# Altium schematic sheet 28Pins_Schematic.SchDoc (part 5 of 5)
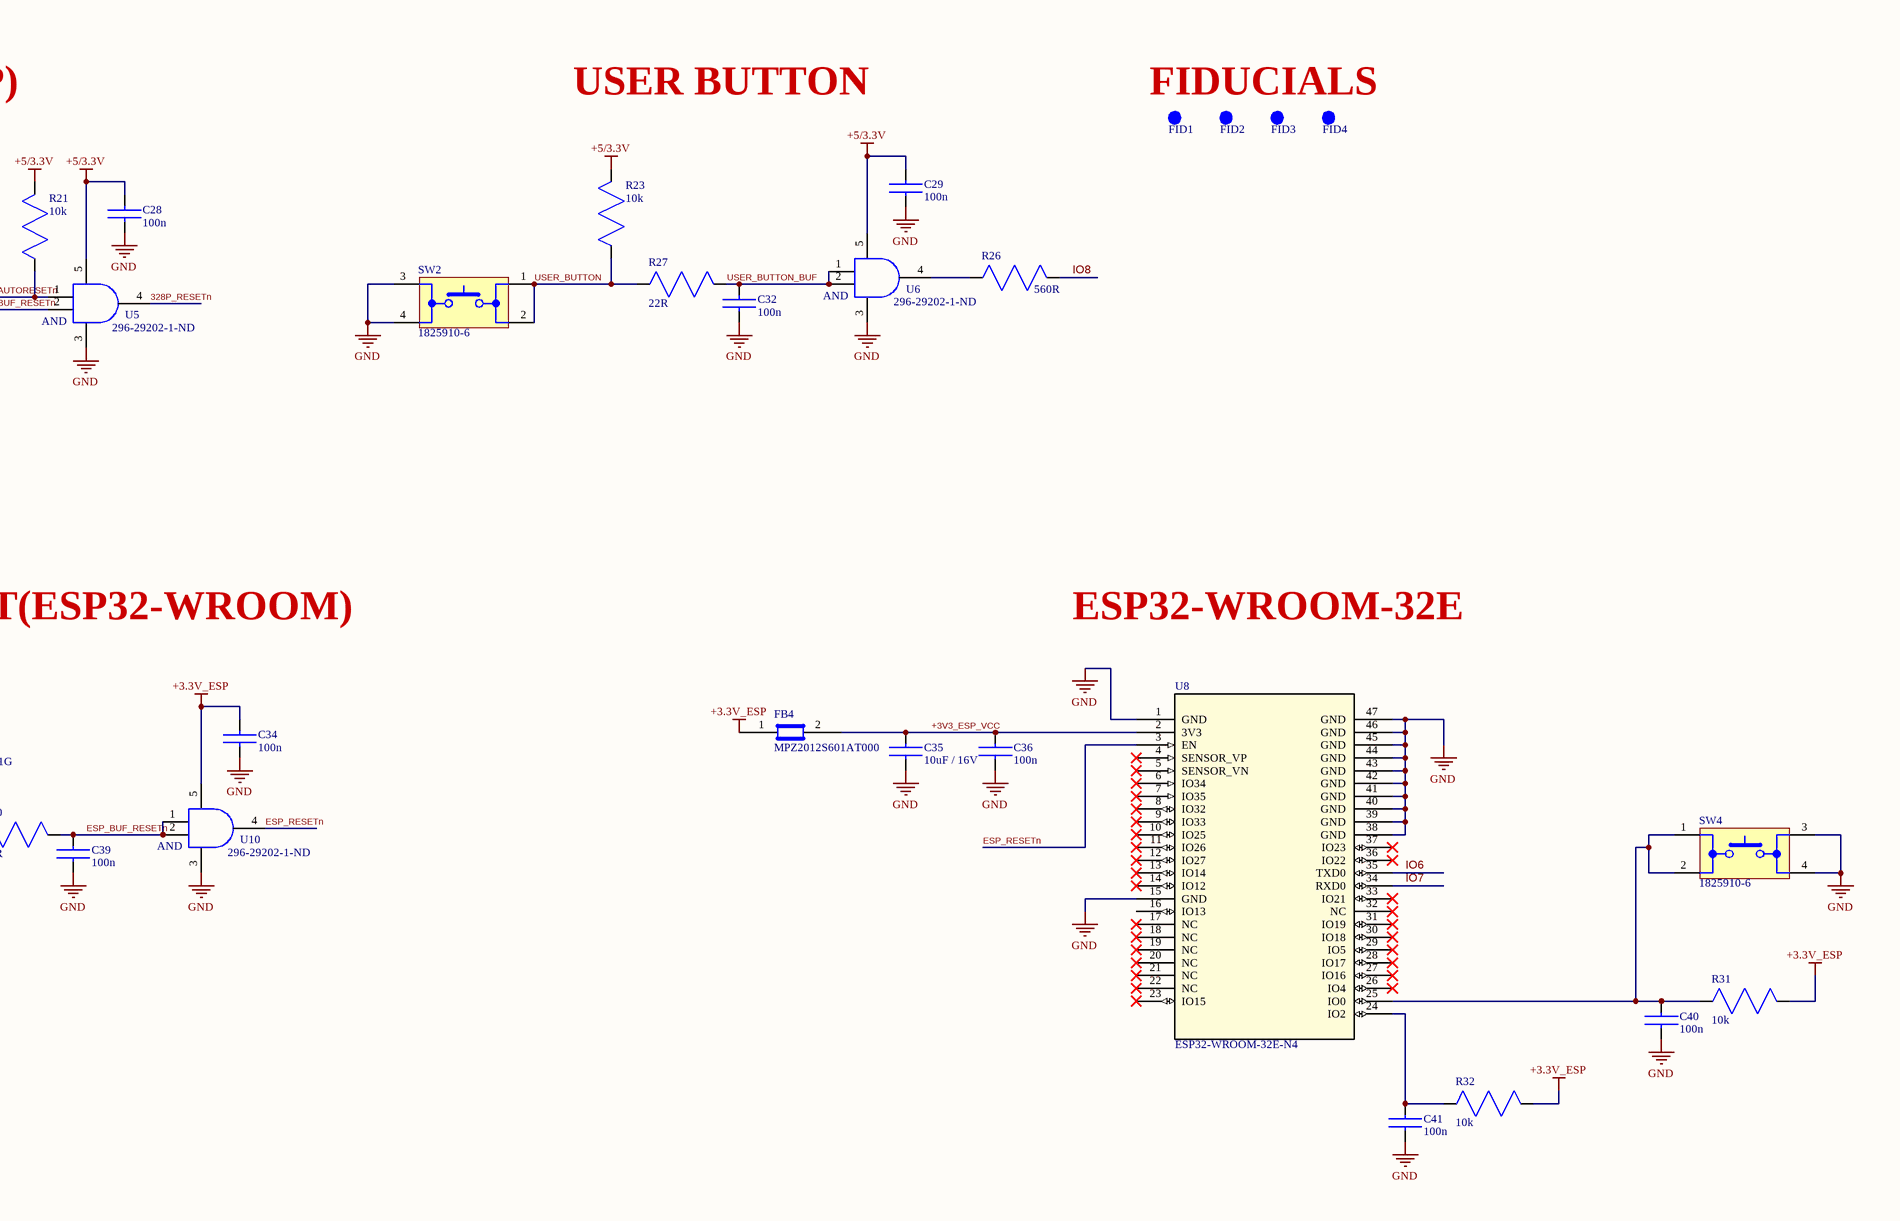
[diagram p7: 28Pins_Schematic.SchDoc, bottom right]

## Library data of the parts (continued)
U4 = ATMEGA328P-PU: Microchip - ATMEGA328P-PU - Microcontroller Mcu, 8 Bit, Atmega, 20MHZ, DIP-28; Core Architecture: AVR; Data Bus Width: 8b; Interface: 2-Wire, I2C, SPI, UART, USART; Max Supply Voltage: 5.5V; Memory Size: 32kB; Memory Format: FLASH; Min Supply Voltage: 1.8V; Number of ADC Channels: 6; Number of I2C Channels: 1; Number of I/Os: 23; Number of Timers/Counters: 3; Oscillator Type: Internal; Peripherals: Brown-out Detect/Reset, POR, PWM, WDT; RAM Size: 2kB; Watchdog Timer: Yes; Supplier: Farnell; Supplier Part Number: 1715487; Manufacturer: Microchip; Manufacturer Part Number: ATMEGA328P-PU; RoHS: Compliant; Category: Microcontrollers; Stock: 17449; Pricing: 1=3.296, 25=3.229 (USD); Projected EOL Date: 2039-11-04; Case/Package: PDIP; Contact Plating: Tin; Country of Assembly: Thailand; Country of Fabrication: United States of America; Country of Origin: Thailand; Export Control Classification Number (ECCN) Code: EAR99; Frequency: 20MHz; Height: 3.28mm; Harmonized Tariff Schedule (HTS) Code: 8542.31.0015; Lead Free: Lead Free; Length: 37.4mm; Lifecycle Status: Production; Clock Frequency: 20MHz; Max Operating Temperature: 85°C; Min Operating Temperature: -40°C; Mounting Technology: Through Hole; Pins: 28; Number of Programmable I/O: 23; Number of PWM Channels: 6; Number of SPI Channels: 1; Radiation Hardening: No; REACH SVHC: No; Schedule B: 8542310000, 8542310000|8542310000|8542310000|8542310000|8542310000; Width: 6.76mm; ComponentLink1URL: https://datasheet.octopart.com:443/ATMEGA328P-PU-Atmel-datasheet-34147914.pdf?src-supplier=Upverter; ComponentLink1Description: https://datasheet.octopart.com:443/ATMEGA328P-PU-Atmel-datasheet-34147914.pdf?src-supplier=Upverter; ComponentLink2URL: https://datasheet.octopart.com:443/ATMEGA328P-PU-Microchip-datasheet-14421303.pdf?src-supplier=Upverter; ComponentLink2Description: https://datasheet.octopart.com:443/ATMEGA328P-PU-Microchip-datasheet-14421303.pdf?src-supplier=Upverter; ComponentLink3URL: https://datasheet.octopart.com:443/ATMEGA328P-PU-Atmel-datasheet-14353408.pdf?src-supplier=Upverter; ComponentLink3Description: https://datasheet.octopart.com:443/ATMEGA328P-PU-Atmel-datasheet-14353408.pdf?src-supplier=Upverter; ComponentLink4URL: https://datasheet.octopart.com:443/ATMEGA328P-PU-Microchip-datasheet-68295846.pdf?src-supplier=SHENGYU+ELECTRONICS; ComponentLink4Description: https://datasheet.octopart.com:443/ATMEGA328P-PU-Microchip-datasheet-68295846.pdf?src-supplier=SHENGYU+ELECTRONICS; ComponentLink5URL: https://datasheet.octopart.com:443/ATMEGA328P-PU-Microchip-datasheet-133520744.pdf?src-supplier=LKR; ComponentLink5Description: https://datasheet.octopart.com:443/ATMEGA328P-PU-Microchip-datasheet-133520744.pdf?src-supplier=LKR; ComponentLink6URL: https://datasheet.octopart.com:443/ATMEGA328P-PU-Microchip-datasheet-62316222.pdf?src-supplier=element14+APAC; ComponentLink6Description: https://datasheet.octopart.com:443/ATMEGA328P-PU-Microchip-datasheet-62316222.pdf?src-supplier=element14+APAC; ComponentLink7URL: https://datasheet.octopart.com:443/ATMEGA328P-PU-Atmel-datasheet-13381135.pdf?src-supplier=element14+APAC; ComponentLink7Description: https://datasheet.octopart.com:443/ATMEGA328P-PU-Atmel-datasheet-13381135.pdf?src-supplier=element14+APAC; ComponentLink8URL: https://datasheet.octopart.com:443/ATMEGA328P-PU-Microchip-datasheet-147334532.pdf?src-supplier=Microchip; ComponentLink8Description: https://datasheet.octopart.com:443/ATMEGA328P-PU-Microchip-datasheet-147334532.pdf?src-supplier=Microchip; ComponentLink9URL: https://datasheet.octopart.com:443/ATMEGA328P-PU-Microchip-datasheet-148646239.pdf?src-supplier=Microchip; ComponentLink9Description: https://datasheet.octopart.com:443/ATMEGA328P-PU-Microchip-datasheet-148646239.pdf?src-supplier=Microchip; ComponentLink10URL: https://datasheet.octopart.com:443/ATMEGA328P-PU-Microchip-datasheet-154741723.pdf?src-supplier=Electro+Sonic; ComponentLink10Description: https://datasheet.octopart.com:443/ATMEGA328P-PU-Microchip-datasheet-154741723.pdf?src-supplier=Electro+Sonic; ComponentLink11URL: https://datasheet.octopart.com:443/ATMEGA328P-PU-Microchip-datasheet-100453898.pdf?src-supplier=Burklin+Elektronik; ComponentLink11Description: https://datasheet.octopart.com:443/ATMEGA328P-PU-Microchip-datasheet-100453898.pdf?src-supplier=Burklin+Elektronik; ComponentLink12URL: https://datasheet.octopart.com:443/ATMEGA328P-PU-Atmel-datasheet-30457899.pdf?src-supplier=Seeed+Studio; ComponentLink12Description: https://datasheet.octopart.com:443/ATMEGA328P-PU-Atmel-datasheet-30457899.pdf?src-supplier=Seeed+Studio; ComponentLink13URL: https://datasheet.octopart.com:443/ATMEGA328P-PU-Microchip-datasheet-10842036.pdf?src-supplier=SOS+electronic; ComponentLink13Description: https://datasheet.octopart.com:443/ATMEGA328P-PU-Microchip-datasheet-10842036.pdf?src-supplier=SOS+electronic; ComponentLink14URL: https://datasheet.octopart.com:443/ATMEGA328P-PU-Microchip-datasheet-8364063.pdf?src-supplier=Jameco; ComponentLink14Description: https://datasheet.octopart.com:443/ATMEGA328P-PU-Microchip-datasheet-8364063.pdf?src-supplier=Jameco; ComponentLink15URL: https://datasheet.octopart.com:443/ATMEGA328P-PU-Microchip-datasheet-154323124.pdf?src-supplier=Jameco; ComponentLink15Description: https://datasheet.octopart.com:443/ATMEGA328P-PU-Microchip-datasheet-154323124.pdf?src-supplier=Jameco; ComponentLink16URL: https://datasheet.octopart.com:443/ATMEGA328P-PU-Atmel-datasheet-10389530.pdf?src-supplier=Newark; ComponentLink16Description: https://datasheet.octopart.com:443/ATMEGA328P-PU-Atmel-datasheet-10389530.pdf?src-supplier=Newark; ComponentLink17URL: https://datasheet.octopart.com:443/ATMEGA328P-PU-Microchip-datasheet-65729177.pdf?src-supplier=TME; ComponentLink17Description: https://datasheet.octopart.com:443/ATMEGA328P-PU-Microchip-datasheet-65729177.pdf?src-supplier=TME; ComponentLink18URL: https://datasheet.octopart.com:443/ATMEGA328P-PU-Microchip-datasheet-101746195.pdf?src-supplier=Future+Electronics; ComponentLink18Description: https://datasheet.octopart.com:443/ATMEGA328P-PU-Microchip-datasheet-101746195.pdf?src-supplier=Future+Electronics; ComponentLink19URL: http://sigma.octopart.com:80/188450569/materials_sheet/Microchip-ATMEGA328P-PU.pdf?src-supplier=Compliance+Statements; ComponentLink19Description: http://sigma.octopart.com:80/188450569/materials_sheet/Microchip-ATMEGA328P-PU.pdf?src-supplier=Compliance+Statements; ComponentLink20URL: http://sigma.octopart.com:80/conflict_mineral_statement/Microchip-company-68.pdf?src-supplier=Compliance+Statements; ComponentLink20Description: http://sigma.octopart.com:80/conflict_mineral_statement/Microchip-company-68.pdf?src-supplier=Compliance+Statements; ComponentLink21URL: http://sigma.octopart.com:80/conflict_mineral_statement/Microchip-company-69.pdf?src-supplier=Compliance+Statements; ComponentLink21Description: http://sigma.octopart.com:80/conflict_mineral_statement/Microchip-company-69.pdf?src-supplier=Compliance+Statements; ComponentLink22URL: http://sigma.octopart.com:80/reach_statement/Microchip-company-70.pdf?src-supplier=Compliance+Statements; ComponentLink22Description: http://sigma.octopart.com:80/reach_statement/Microchip-company-70.pdf?src-supplier=Compliance+Statements; ComponentLink23URL: http://sigma.octopart.com:80/rohs_statement/Microchip-company-71.pdf?src-supplier=Compliance+Statements; ComponentLink23Description: http://sigma.octopart.com:80/rohs_statement/Microchip-company-71.pdf?src-supplier=Compliance+Statements; ComponentLink24URL: http://sigma.octopart.com:80/rohs_statement/Atmel-company-4.pdf?src-supplier=Compliance+Statements; ComponentLink24Description: http://sigma.octopart.com:80/rohs_statement/Atmel-company-4.pdf?src-supplier=Compliance+Statements; ComponentLink25URL: http://sigma.octopart.com:80/rohs_statement/Atmel-company-5.pdf?src-supplier=Compliance+Statements; ComponentLink25Description: http://sigma.octopart.com:80/rohs_statement/Atmel-company-5.pdf?src-supplier=Compliance+Statements; ComponentLink26URL: http://sigma.octopart.com:80/reach_statement/Atmel-company-6.pdf?src-supplier=Compliance+Statements; ComponentLink26Description: http://sigma.octopart.com:80/reach_statement/Atmel-company-6.pdf?src-supplier=Compliance+Statements
U8 = ESP32-WROOM-32E-N4: WLAN+BT Module 2412MHz to 2484MHz 47-Pin SMD Module; Manufacturer: Espressif Systems; Max Supply Voltage: 3.6V; Min Supply Voltage: 3V; Operating Supply Voltage: 3.3V; Supplier: DigiKey; Supplier Part Number: 1965-ESP32-WROOM-32E-N4CT-ND; Manufacturer Part Number: ESP32-WROOM-32E-N4; RoHS: Compliant; Category: System on Chip (SoC); Stock: 15868; Pricing: 1=4.84, 10=4.189, 25=3.9612, 100=3.649, 250=3.46184 (USD); Height - Seated (Max): 3.25mm; Length: 25.5mm; Max Operating Temperature: 85°C; Min Operating Temperature: -40°C; Number of Terminals: 38; Terminal Pitch: 1.27mm; Width: 18mm; ComponentLink1URL: https://datasheet.octopart.com:443/ESP32-WROOM-32E-N4-Espressif-Systems-datasheet-182247776.pdf?src-supplier=IHS; ComponentLink1Description: https://datasheet.octopart.com:443/ESP32-WROOM-32E-N4-Espressif-Systems-datasheet-182247776.pdf?src-supplier=IHS; ComponentLink2URL: https://datasheet.octopart.com:443/ESP32-WROOM-32E-N4-Espressif-Systems-datasheet-188867343.pdf?src-supplier=TME; ComponentLink2Description: https://datasheet.octopart.com:443/ESP32-WROOM-32E-N4-Espressif-Systems-datasheet-188867343.pdf?src-supplier=TME; ComponentLink3URL: https://datasheet.octopart.com:443/ESP32-WROOM-32E-N4-Espressif-Systems-datasheet-165560559.pdf?src-supplier=TME; ComponentLink3Description: https://datasheet.octopart.com:443/ESP32-WROOM-32E-N4-Espressif-Systems-datasheet-165560559.pdf?src-supplier=TME; ComponentLink4URL: https://datasheet.octopart.com:443/ESP32-WROOM-32E-N4-Espressif-Systems-datasheet-151884363.pdf?src-supplier=Future+Electronics; ComponentLink4Description: https://datasheet.octopart.com:443/ESP32-WROOM-32E-N4-Espressif-Systems-datasheet-151884363.pdf?src-supplier=Future+Electronics
U9 = AP2112K-3.3TRG1: AP2112 Series 0.6 A 3.3 V Fixed Output SMT LDO Linear Regulator - SOT23-5; Manufacturer: Diodes Inc.; Accuracy: 1.5%; Dropout Voltage: 250mV; Max Supply Voltage: 6V; Max Junction Temperature (Tj): 85°C; Max Output current: 600mA; Min Input Voltage: 2.5V; Nominal Supply Current: 55µA; Number of Channels: 1; Output Voltage: 3.3V; Polarity: Positive; Supplier: DigiKey; Supplier Part Number: AP2112K-3.3TRG1DICT-ND; Manufacturer Part Number: AP2112K-3.3TRG1; RoHS: Compliant; Category: LDO Voltage Regulators; Stock: 48510; Pricing: 1=0.22, 10=0.153, 25=0.1348, 100=0.1151, 250=0.10576, 500=0.1001, 1000=0.09545 (USD); Ambient Temperature Range High: 85°C; Case/Package: SOT-23-5; China RoHS: Compliant; Height: 1.4mm; Height - Seated (Max): 1.45mm; Lead Free: Lead Free; Length: 2.92mm; Lifecycle Status: Production; Max Operating Temperature: 85°C; Min Operating Temperature: -40°C; Min Supply Voltage: 2.5V; Mounting Technology: Surface Mount; Number of Circuits: 1; Number of Outputs: 1; Pins: 5; Number of Regulators: 1; Number of Terminals: 5; Output Current: 600mA; Output Type: Fixed; Packaging: Digi-Reel®; Quiescent Current: 55µA; REACH SVHC: Yes; Schedule B: 8542390000, 8542390000|8542390000|8542390000|8542390000|8542390000; Terminal Pitch: 950µm; Voltage Tolerance: 1.5%; Width: 1.6mm; ComponentLink1URL: https://datasheet.octopart.com:443/AP2112K-3.3TRG1-Diodes-Inc.-datasheet-101745658.pdf?src-supplier=IHS; ComponentLink1Description: https://datasheet.octopart.com:443/AP2112K-3.3TRG1-Diodes-Inc.-datasheet-101745658.pdf?src-supplier=IHS; ComponentLink2URL: https://datasheet.octopart.com:443/AP2112K-3.3TRG1-Diodes-Inc.-datasheet-182385097.pdf?src-supplier=IHS; ComponentLink2Description: https://datasheet.octopart.com:443/AP2112K-3.3TRG1-Diodes-Inc.-datasheet-182385097.pdf?src-supplier=IHS; ComponentLink3URL: https://datasheet.octopart.com:443/AP2112K-3.3TRG1-Diodes-Inc.-datasheet-37177583.pdf?src-supplier=SHENGYU+ELECTRONICS; ComponentLink3Description: https://datasheet.octopart.com:443/AP2112K-3.3TRG1-Diodes-Inc.-datasheet-37177583.pdf?src-supplier=SHENGYU+ELECTRONICS; ComponentLink4URL: https://sigma.octopart.com:443/138895853/technical_drawing/Diodes-Inc.-AP2112K-3.3TRG1.pdf?src-supplier=Upverter; ComponentLink4Description: https://sigma.octopart.com:443/138895853/technical_drawing/Diodes-Inc.-AP2112K-3.3TRG1.pdf?src-supplier=Upverter
Y1 Y2 = ABM7-16.000MHZ-D2Y-T: Crystal 16MHz ±20ppm (Tol) ±30ppm (Stability) 18pF FUND 50Ohm 2-Pin Mini-CSMD T/R; Manufacturer: Abracon; ESR (Equivalent Series Resistance): 50Ω; Frequency Tolerance: 0.002%; Supplier: DigiKey; Supplier Part Number: 535-9840-1-ND; Manufacturer Part Number: ABM7-16.000MHZ-D2Y-T; RoHS: Compliant; Category: Crystals; Stock: 23304; Pricing: 1=0.64, 10=0.553, 25=0.5228, 50=0.501, 100=0.4803, 250=0.45424, 500=0.43544 (USD); Case/Package: CSMD; China RoHS: Non-Compliant; Composition: Ceramic; Depth: 3.5mm; Frequency: 16MHz; Frequency Stability: 30ppm; Height: 1.4mm; Lead Free: Lead Free; Length: 6mm; Lifecycle Status: Production; Load Capacitance: 18pF; Max Operating Temperature: 85°C; Min Operating Temperature: -40°C; Mounting Technology: Surface Mount; Pins: 2; Radiation Hardening: No; REACH SVHC: Yes; Schedule B: 8541600025, 8541600025|8541600025|8541600025|8541600025|8541600025, 8541600080; ESR: 50Ω; Termination: SMD/SMT; Tolerance: 0.002%; Width: 3.5mm; ComponentLink1URL: https://datasheet.octopart.com:443/ABM7-16.000MHZ-D2Y-T-Abracon-datasheet-103053454.pdf?src-supplier=ODG+(Origin+Data+Global); ComponentLink1Description: https://datasheet.octopart.com:443/ABM7-16.000MHZ-D2Y-T-Abracon-datasheet-103053454.pdf?src-supplier=ODG+(Origin+Data+Global); ComponentLink2URL: https://datasheet.octopart.com:443/ABM7-16.000MHZ-D2Y-T-Abracon-datasheet-10672703.pdf?src-supplier=Farnell; ComponentLink2Description: https://datasheet.octopart.com:443/ABM7-16.000MHZ-D2Y-T-Abracon-datasheet-10672703.pdf?src-supplier=Farnell; ComponentLink3URL: https://datasheet.octopart.com:443/ABM7-16.000MHZ-D2Y-T-Abracon-datasheet-8837364.pdf?src-supplier=Upverter; ComponentLink3Description: https://datasheet.octopart.com:443/ABM7-16.000MHZ-D2Y-T-Abracon-datasheet-8837364.pdf?src-supplier=Upverter; ComponentLink4URL: https://datasheet.octopart.com:443/ABM7-16.000MHZ-D2Y-T-Abracon-datasheet-8817375.pdf?src-supplier=Upverter; ComponentLink4Description: https://datasheet.octopart.com:443/ABM7-16.000MHZ-D2Y-T-Abracon-datasheet-8817375.pdf?src-supplier=Upverter; ComponentLink5URL: https://datasheet.octopart.com:443/ABM7-16.000MHZ-D2Y-T-Abracon-datasheet-8699803.pdf?src-supplier=Upverter; ComponentLink5Description: https://datasheet.octopart.com:443/ABM7-16.000MHZ-D2Y-T-Abracon-datasheet-8699803.pdf?src-supplier=Upverter; ComponentLink6URL: https://datasheet.octopart.com:443/ABM7-16.000MHZ-D2Y-T-Abracon-datasheet-8623263.pdf?src-supplier=Upverter; ComponentLink6Description: https://datasheet.octopart.com:443/ABM7-16.000MHZ-D2Y-T-Abracon-datasheet-8623263.pdf?src-supplier=Upverter; ComponentLink7URL: https://datasheet.octopart.com:443/ABM7-16.000MHZ-D2Y-T-Abracon-datasheet-8452219.pdf?src-supplier=Upverter; ComponentLink7Description: https://datasheet.octopart.com:443/ABM7-16.000MHZ-D2Y-T-Abracon-datasheet-8452219.pdf?src-supplier=Upverter; ComponentLink8URL: https://datasheet.octopart.com:443/ABM7-16.000MHZ-D2Y-T-Abracon-datasheet-8330406.pdf?src-supplier=Upverter; ComponentLink8Description: https://datasheet.octopart.com:443/ABM7-16.000MHZ-D2Y-T-Abracon-datasheet-8330406.pdf?src-supplier=Upverter; ComponentLink9URL: https://datasheet.octopart.com:443/ABM7-16.000MHZ-D2Y-T-Abracon-datasheet-5320088.pdf?src-supplier=Upverter; ComponentLink9Description: https://datasheet.octopart.com:443/ABM7-16.000MHZ-D2Y-T-Abracon-datasheet-5320088.pdf?src-supplier=Upverter; ComponentLink10URL: https://datasheet.octopart.com:443/ABM7-16.000MHZ-D2Y-T-Abracon-datasheet-157440075.pdf?src-supplier=Sager+Electronics; ComponentLink10Description: https://datasheet.octopart.com:443/ABM7-16.000MHZ-D2Y-T-Abracon-datasheet-157440075.pdf?src-supplier=Sager+Electronics; ComponentLink11URL: https://sigma.octopart.com:443/141159867/technical_drawing/Abracon-ABM7-16.000MHZ-D2Y-T.pdf?src-supplier=Abracon+SCT; ComponentLink11Description: https://sigma.octopart.com:443/141159867/technical_drawing/Abracon-ABM7-16.000MHZ-D2Y-T.pdf?src-supplier=Abracon+SCT; ComponentLink12URL: https://datasheet.octopart.com:443/ABM7-16.000MHZ-D2Y-T-Abracon-datasheet-15994676.pdf?src-supplier=TME; ComponentLink12Description: https://datasheet.octopart.com:443/ABM7-16.000MHZ-D2Y-T-Abracon-datasheet-15994676.pdf?src-supplier=TME; ComponentLink13URL: http://sigma.octopart.com:80/conflict_mineral_statement/Abracon-company-27.pdf?src-supplier=Compliance+Statements; ComponentLink13Description: http://sigma.octopart.com:80/conflict_mineral_statement/Abracon-company-27.pdf?src-supplier=Compliance+Statements
Z1 Z2 = CG0603MLC-05E: ESD Suppressor Multilayer Varistor 5V Automotive 2-Pin Case 0603(1608Metric) T/R; Manufacturer: Bourns; Value: 500fF; Clamping Voltage: 20V; Current Rating: 50nA; Element Configuration: Single; Number of Channels: 1; Turn-On Delay Time: 1ns; Voltage Rating (AC): 8V; Supplier: DigiKey; Supplier Part Number: CG0603MLC-05ECT-ND; Manufacturer Part Number: CG0603MLC-05E; RoHS: Compliant; Category: Resistors; Stock: 1582; Pricing: 1=0.25, 10=0.169, 25=0.15, 100=0.1283, 250=0.11804, 500=0.11182, 1000=0.10671, 2500=0.10404 (USD); Case/Package: 0603; Case Code (Imperial): 0603; Case Code (Metric): 1608; China RoHS: Compliant; Contact Plating: Silver; Depth: 800µm; Height: 510µm; Leakage Current: 50nA; Length: 1.6mm; Lifecycle Status: NRND; Max Operating Temperature: 125°C; Max Voltage Rating (DC): 5V; Min Operating Temperature: -55°C; Mounting Technology: Surface Mount; Number of Circuits: 1; Pins: 2; Number of Terminals: 2; Packaging: Tape and Reel; Radiation Hardening: No; REACH SVHC: Yes; Schedule B: 8536300000, 8536300000|8536300000, 8536300000|8536300000|8536300000, 8536300000|8536300000|8536300000|8536300000; Termination: SMD/SMT; Thickness: 800µm; Voltage: 5V; Voltage Rating (DC): 5V; Width: 850µm; Working Voltage: 5V; ComponentLink1URL: https://datasheet.octopart.com:443/CG0603MLC-05E-Bourns-datasheet-182141775.pdf?src-supplier=IHS; ComponentLink1Description: https://datasheet.octopart.com:443/CG0603MLC-05E-Bourns-datasheet-182141775.pdf?src-supplier=IHS; ComponentLink2URL: https://datasheet.octopart.com:443/CG0603MLC-05E-Bourns-datasheet-17172219.pdf?src-supplier=Upverter; ComponentLink2Description: https://datasheet.octopart.com:443/CG0603MLC-05E-Bourns-datasheet-17172219.pdf?src-supplier=Upverter; ComponentLink3URL: https://datasheet.octopart.com:443/CG0603MLC-05E-Bourns-datasheet-8497455.pdf?src-supplier=Upverter; ComponentLink3Description: https://datasheet.octopart.com:443/CG0603MLC-05E-Bourns-datasheet-8497455.pdf?src-supplier=Upverter; ComponentLink4URL: https://datasheet.octopart.com:443/CG0603MLC-05E-Bourns-datasheet-21823698.pdf?src-supplier=Master+Electronics; ComponentLink4Description: https://datasheet.octopart.com:443/CG0603MLC-05E-Bourns-datasheet-21823698.pdf?src-supplier=Master+Electronics; ComponentLink5URL: https://datasheet.octopart.com:443/CG0603MLC-05E-Bourns-datasheet-80871568.pdf?src-supplier=Farnell; ComponentLink5Description: https://datasheet.octopart.com:443/CG0603MLC-05E-Bourns-datasheet-80871568.pdf?src-supplier=Farnell; ComponentLink6URL: https://datasheet.octopart.com:443/CG0603MLC-05E-Bourns-datasheet-94104127.pdf?src-supplier=Farnell; ComponentLink6Description: https://datasheet.octopart.com:443/CG0603MLC-05E-Bourns-datasheet-94104127.pdf?src-supplier=Farnell; ComponentLink7URL: https://datasheet.octopart.com:443/CG0603MLC-05E-Bourns-datasheet-13383913.pdf?src-supplier=Electro+Sonic; ComponentLink7Description: https://datasheet.octopart.com:443/CG0603MLC-05E-Bourns-datasheet-13383913.pdf?src-supplier=Electro+Sonic; ComponentLink8URL: https://datasheet.octopart.com:443/CG0603MLC-05E-Bourns-datasheet-169697978.pdf?src-supplier=Burklin+Elektronik; ComponentLink8Description: https://datasheet.octopart.com:443/CG0603MLC-05E-Bourns-datasheet-169697978.pdf?src-supplier=Burklin+Elektronik; ComponentLink9URL: https://datasheet.octopart.com:443/CG0603MLC-05E-Bourns-datasheet-14050724.pdf?src-supplier=iiiC; ComponentLink9Description: https://datasheet.octopart.com:443/CG0603MLC-05E-Bourns-datasheet-14050724.pdf?src-supplier=iiiC; ComponentLink10URL: https://datasheet.octopart.com:443/CG0603MLC-05E-Bourns-datasheet-5391063.pdf?src-supplier=Verical; ComponentLink10Description: https://datasheet.octopart.com:443/CG0603MLC-05E-Bourns-datasheet-5391063.pdf?src-supplier=Verical; ComponentLink11URL: https://datasheet.octopart.com:443/CG0603MLC-05E-Bourns-datasheet-7620537.pdf?src-supplier=Jameco; ComponentLink11Description: https://datasheet.octopart.com:443/CG0603MLC-05E-Bourns-datasheet-7620537.pdf?src-supplier=Jameco; ComponentLink12URL: https://datasheet.octopart.com:443/CG0603MLC-05E-Bourns-datasheet-53157.pdf?src-supplier=RS+(Formerly+Allied+Electronics); ComponentLink12Description: https://datasheet.octopart.com:443/CG0603MLC-05E-Bourns-datasheet-53157.pdf?src-supplier=RS+(Formerly+Allied+Electronics); ComponentLink13URL: https://datasheet.octopart.com:443/CG0603MLC-05E-Bourns-datasheet-48705.pdf?src-supplier=Mouser; ComponentLink13Description: https://datasheet.octopart.com:443/CG0603MLC-05E-Bourns-datasheet-48705.pdf?src-supplier=Mouser; ComponentLink14URL: http://sigma.octopart.com:80/15887669/rohs_statement/Bourns-CG0603MLC-05E.pdf?src-supplier=Compliance+Statements; ComponentLink14Description: http://sigma.octopart.com:80/15887669/rohs_statement/Bourns-CG0603MLC-05E.pdf?src-supplier=Compliance+Statements; ComponentLink15URL: http://sigma.octopart.com:80/conflict_mineral_statement/Bourns-company-36.pdf?src-supplier=Compliance+Statements; ComponentLink15Description: http://sigma.octopart.com:80/conflict_mineral_statement/Bourns-company-36.pdf?src-supplier=Compliance+Statements